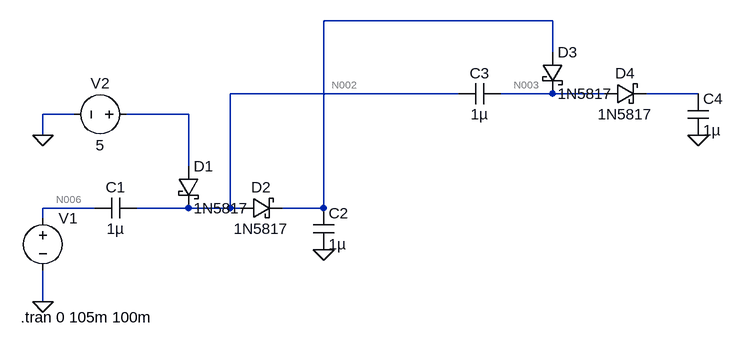
[diagram p0: schematic voltage mult.asc]
voltage mult.asc, the LTspice schematic file:
Version 4
SHEET 1 880 680
WIRE 256 -96 -96 -96
WIRE 256 -48 256 -96
WIRE 112 16 -240 16
WIRE 256 16 176 16
WIRE 336 16 256 16
WIRE 480 16 400 16
WIRE -480 48 -528 48
WIRE -304 48 -400 48
WIRE -528 80 -528 48
WIRE -304 128 -304 48
WIRE -448 192 -528 192
WIRE -304 192 -384 192
WIRE -240 192 -240 16
WIRE -240 192 -304 192
WIRE -224 192 -240 192
WIRE -96 192 -96 -96
WIRE -96 192 -160 192
WIRE -528 208 -528 192
WIRE -528 336 -528 288
FLAG -96 256 0
FLAG 480 80 0
FLAG -528 80 0
FLAG -528 336 0
SYMBOL cap -384 176 R90
WINDOW 0 0 32 VBottom 2
WINDOW 3 32 32 VTop 2
SYMATTR InstName C1
SYMATTR Value 1µ
SYMBOL schottky -320 128 R0
SYMATTR InstName D1
SYMATTR Value 1N5817
SYMATTR Description Diode
SYMATTR Type diode
SYMBOL schottky -224 208 R270
WINDOW 0 32 32 VTop 2
WINDOW 3 0 32 VBottom 2
SYMATTR InstName D2
SYMATTR Value 1N5817
SYMATTR Description Diode
SYMATTR Type diode
SYMBOL cap -112 192 R0
SYMATTR InstName C2
SYMATTR Value 1µ
SYMBOL schottky 240 -48 R0
SYMATTR InstName D3
SYMATTR Value 1N5817
SYMATTR Description Diode
SYMATTR Type diode
SYMBOL cap 176 0 R90
WINDOW 0 0 32 VBottom 2
WINDOW 3 32 32 VTop 2
SYMATTR InstName C3
SYMATTR Value 1µ
SYMBOL schottky 336 32 R270
WINDOW 0 32 32 VTop 2
WINDOW 3 0 32 VBottom 2
SYMATTR InstName D4
SYMATTR Value 1N5817
SYMATTR Description Diode
SYMATTR Type diode
SYMBOL cap 464 16 R0
SYMATTR InstName C4
SYMATTR Value 1µ
SYMBOL voltage -528 192 R0
WINDOW 3 24 96 Invisible 2
WINDOW 123 0 0 Left 2
WINDOW 39 0 0 Left 2
SYMATTR InstName V1
SYMATTR Value PULSE(0 5 0 10n 10n 100u 200u)
SYMBOL voltage -384 48 R90
WINDOW 0 -32 56 VBottom 2
WINDOW 3 32 56 VTop 2
WINDOW 123 0 0 Left 2
WINDOW 39 0 0 Left 2
SYMATTR InstName V2
SYMATTR Value 5
TEXT -562 360 Left 2 !.tran 0 105m 100m

The netlist it stands for:
* voltage mult.asc
C1 N002 N006 1µ
D1 N005 N002 1N5817
D2 N002 N001 1N5817
C2 N001 0 1µ
D3 N001 N003 1N5817
C3 N003 N002 1µ
D4 N003 N004 1N5817
C4 N004 0 1µ
V1 N006 0 PULSE(0 5 0 10n 10n 100u 200u)
V2 N005 0 5
.model D D
.lib standard.dio
.tran 0 105m 100m
.backanno
.end

* Results of the author's LTspice run, read from the files saved beside the schematic
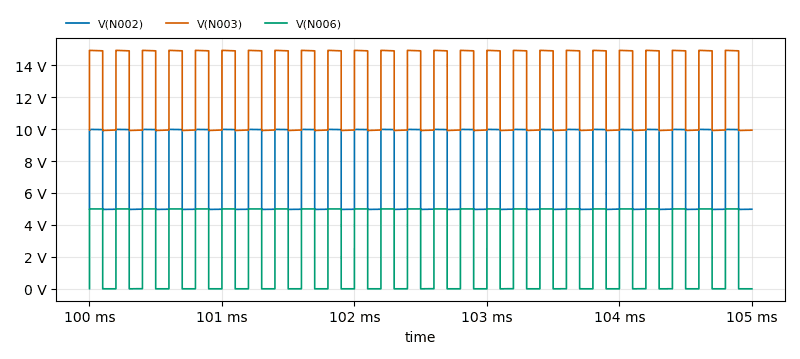
[diagram p1: Transient Analysis of voltage mult.asc, plotted from the saved traces]
* Transient Analysis, 1 run:
*   V(N002): min 4.969 V, max 9.979 V, average 7.474 V, rms 7.88 V, last 4.981 V
*   V(N003): min 9.911 V, max 14.93 V, average 12.42 V, rms 12.67 V, last 9.93 V
*   V(N006): min 0 V, max 5 V, average 2.5 V, rms 3.536 V, last 0 V